# Altium schematic sheet Узел разъёма usb.SchDoc
size A4; Address1: Address1; Address2: Address2; Address3: Address3; Address4: Address4; DocumentNumber: АБВГ.123456.001 Э3; SheetNumber: 1; Scale: 1:1; DocumentType: Схема электрическая принципиальная; FirstReferrence: АБВГ.123456.001
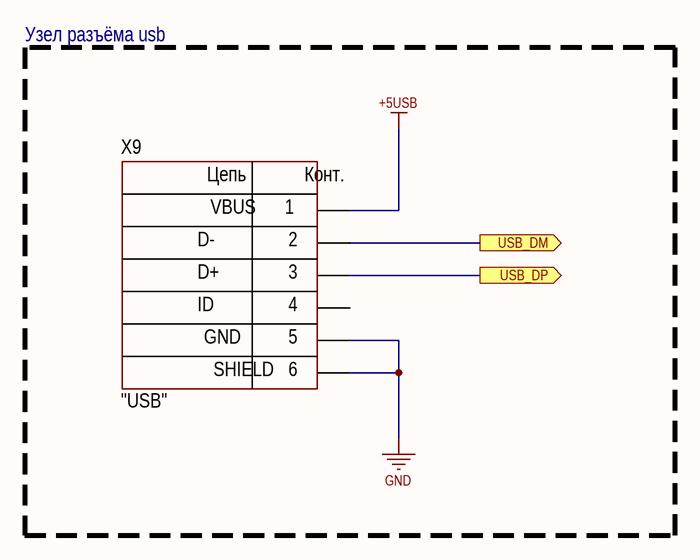
[diagram p0: Узел разъёма usb.SchDoc]

## Parts
X9  CommentText: "USB"  [CON: USB micro-A (ZX62-B-5PA)]

## Blocks framed on the sheet
Узел разъёма usb: X9

## Ports
USB_DM (out), USB_DP (out)

## Nets
+5USB: X9.1
GND: X9.0 X9.5
USB_DM: X9.2 ; port USB_DM
USB_DP: X9.3 ; port USB_DP

Not connected (* = marked no-connect by the designer): X9 4

## Notes on the sheet
- Title
- Size:
- Date:
- A4
- Number:
- Time:
- Revision:
- Sheet
- of
- File:
- (in symbol Connector_USB_micro_B) Цепь; Конт.; VBUS; D-; D+; ID; GND; SHIELD; 6

## Library data of the parts
X9 = Connector_USB_micro_B: Manufacturer: Hirose Electric; ValueManufacturerPartNumber: USB micro B; PartNumber: ZX62-B-5PA; HelpURL: https://www.digikey.com/product-detail/en/hirose-electric-co-ltd/ZX62-B-5PA/H11579CT-ND/1851090; TypeConnector: USB micro B